# Altium schematic sheet ee453_pcb_ret.SchDoc: EE 453 Capstone
size C; ApprovedBy: Your Name; CheckedBy: Your Name; Author: Your Name; CompanyName: Dept. of Elec. and Comp. Engg.; DrawnBy: Your Name; Engineer: Your Nmae; Organization: UW-Seattle; Address1: 185 Stevens Way; Address2: Paul Allen Center; Address3: Seattle, WA; Address4: US-98195; DocumentNumber: 1; Revision: 1.0; SheetNumber: 1; SheetTotal: 1
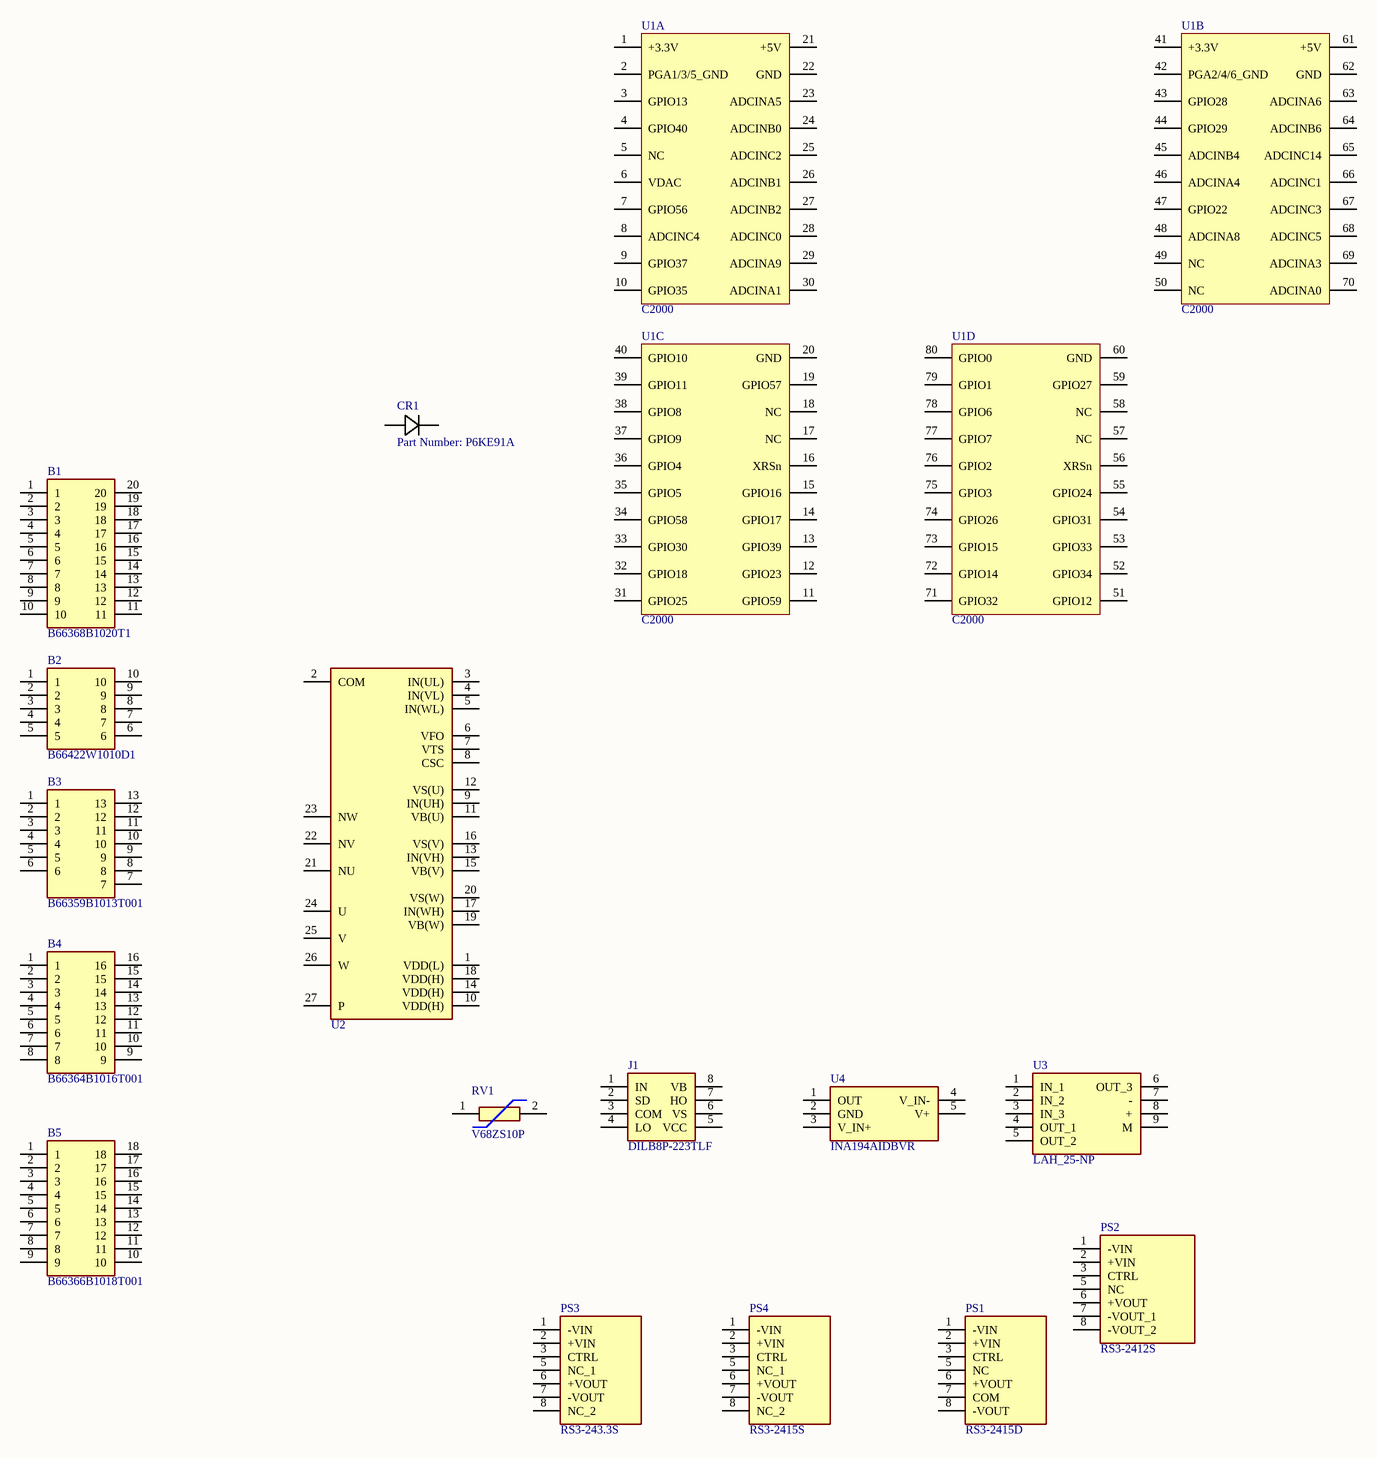
[diagram p0: ee453_pcb_ret.SchDoc]

## Parts
B1  B66368B1020T1  [B66368B1020T1]
B2  B66422W1010D1  [B66422W1010D1]
B3  B66359B1013T001  [B66359B1013T001]
B4  B66364B1016T001  [B66364B1016T001]
B5  B66366B1018T001  [B66366B1018T001]
CR1  Part Number: P6KE91A  [P6KESeries]
J1  DILB8P-223TLF  [DIPS762W60P254L1016H525Q8N]
PS1  RS3-2415D  [RS32405DH3]
PS2  RS3-2412S  [RS32415S]
PS3  RS3-243.3S  [RS32433S]
PS4  RS3-2415S  [RS32415S]
RV1  V68ZS10P  [V68ZS10P]
U1  C2000  [C2000]  (parts A,B,C,D of 4)
U2  FNB34060T  [FNB34060T]  (value not drawn)
U3  LAH_25-NP  [LAH-25-NP]
U4  INA194AIDBVR  [SOT95P280X145-5N]

## Nets

Not connected (* = marked no-connect by the designer): B1 1 2 3 4 5 6 7 8 9 10 11 12 13 14 15 16 17 18 19 20; B2 1 2 3 4 5 6 7 8 9 10; B3 1 2 3 4 5 6 7 8 9 10 11 12 13; B4 1 2 3 4 5 6 7 8 9 10 11 12 13 14 15 16; B5 1 2 3 4 5 6 7 8 9 10 11 12 13 14 15 16 17 18; CR1 1 2; J1 1(IN) 2(SD) 3(COM) 4(LO) 5(VCC) 6(VS) 7(HO) 8(VB); PS1 1(-VIN) 2(+VIN) 3(CTRL) 5(NC) 6(+VOUT) 7(COM) 8(-VOUT); PS2 1(-VIN) 2(+VIN) 3(CTRL) 5(NC) 6(+VOUT) 7(-VOUT_1) 8(-VOUT_2); PS3 1(-VIN) 2(+VIN) 3(CTRL) 5(NC_1) 6(+VOUT) 7(-VOUT) 8(NC_2); PS4 1(-VIN) 2(+VIN) 3(CTRL) 5(NC_1) 6(+VOUT) 7(-VOUT) 8(NC_2); RV1 1 2; U1 1(+3.3V) 2(PGA1/3/5_GND) 3(GPIO13) 4(GPIO40) 5(NC) 6(VDAC) 7(GPIO56) 8(ADCINC4) 9(GPIO37) 10(GPIO35) 11(GPIO59) 12(GPIO23) 13(GPIO39) 14(GPIO17) 15(GPIO16) 16(XRSn) 17(NC) 18(NC) 19(GPIO57) 20(GND) 21(+5V) 22(GND) 23(ADCINA5) 24(ADCINB0) 25(ADCINC2) 26(ADCINB1) 27(ADCINB2) 28(ADCINC0) 29(ADCINA9) 30(ADCINA1) 31(GPIO25) 32(GPIO18) 33(GPIO30) 34(GPIO58) 35(GPIO5) 36(GPIO4) 37(GPIO9) 38(GPIO8) 39(GPIO11) 40(GPIO10) 41(+3.3V) 42(PGA2/4/6_GND) 43(GPIO28) 44(GPIO29) 45(ADCINB4) 46(ADCINA4) 47(GPIO22) 48(ADCINA8) 49(NC) 50(NC) 51(GPIO12) 52(GPIO34) 53(GPIO33) 54(GPIO31) 55(GPIO24) 56(XRSn) 57(NC) 58(NC) 59(GPIO27) 60(GND) 61(+5V) 62(GND) 63(ADCINA6) 64(ADCINB6) 65(ADCINC14) 66(ADCINC1) 67(ADCINC3) 68(ADCINC5) 69(ADCINA3) 70(ADCINA0) 71(GPIO32) 72(GPIO14) 73(GPIO15) 74(GPIO26) 75(GPIO3) 76(GPIO2) 77(GPIO7) 78(GPIO6) 79(GPIO1) 80(GPIO0); U2 1(VDD(L)) 2(COM) 3(IN(UL)) 4(IN(VL)) 5(IN(WL)) 6(VFO) 7(VTS) 8(CSC) 9(IN(UH)) 10(VDD(H)) 11(VB(U)) 12(VS(U)) 13(IN(VH)) 14(VDD(H)) 15(VB(V)) 16(VS(V)) 17(IN(WH)) 18(VDD(H)) 19(VB(W)) 20(VS(W)) 21(NU) 22(NV) 23(NW) 24(U) 25(V) 26(W) 27(P); U3 1(IN_1) 2(IN_2) 3(IN_3) 4(OUT_1) 5(OUT_2) 6(OUT_3) 7(-) 8(+) 9(M); U4 1(OUT) 2(GND) 3(V_IN+) 4(V_IN-) 5(V+)

## Notes on the sheet
- Title
- Size:
- Date:
- File:
- C
- Number:
- Time:
- Revision:
- Sheet
- of

## Library data of the parts
B1 = B66368B1020T1: Bobbin; Manufacturer_Name: EPCOS; Datasheet Link: https://componentsearchengine.com/Datasheets/1/B66368B1020T1.pdf; Height: 40.9mm; Mouser2 Part Number: 871-B66368B1020T1; Mouser2 Price/Stock: https://www.mouser.com/Search/Refine.aspx?Keyword=871-B66368B1020T1; Manufacturer_Part_Number: B66368B1020T1
B2 = B66422W1010D1: Bobbin; Manufacturer_Name: EPCOS; Datasheet Link: https://componentsearchengine.com/Datasheets/1/B66422W1010D1.pdf; Height: 12mm; Mouser2 Part Number: 871-B66422W1010D1; Mouser2 Price/Stock: https://www.mouser.com/Search/Refine.aspx?Keyword=871-B66422W1010D1; Manufacturer_Part_Number: B66422W1010D1
B3 = B66359B1013T001: Bobbin; Manufacturer_Name: EPCOS; Datasheet Link: https://componentsearchengine.com/Datasheets/1/B66359B1013T001.pdf; Height: 25mm; Mouser2 Part Number: 871-B66359B1013T001; Mouser2 Price/Stock: https://www.mouser.com/Search/Refine.aspx?Keyword=871-B66359B1013T001; Manufacturer_Part_Number: B66359B1013T001
B4 = B66364B1016T001: Bobbin; Manufacturer_Name: EPCOS; Datasheet Link: https://componentsearchengine.com/Datasheets/1/B66364B1016T001.pdf; Height: 35.5mm; Mouser2 Part Number: 871-B66364B1016T001; Mouser2 Price/Stock: https://www.mouser.com/Search/Refine.aspx?Keyword=871-B66364B1016T001; Manufacturer_Part_Number: B66364B1016T001
B5 = B66366B1018T001: Bobbin; Manufacturer_Name: EPCOS; Datasheet Link: http://uk.rs-online.com/web/p/products/1620179; Height: 38.4mm; Manufacturer_Part_Number: B66366B1018T001; RS Part Number: 1620179; RS Price/Stock: http://uk.rs-online.com/web/p/products/1620179
CR1 = P6KE91A: No Description Available; Vendor: Littelfuse Inc; Built_By: EMA_UL_Team; Type: DEV; Manufacturer_Part_Number: P6KE91A; Copyright: Copyright (C) 2018 Accelerated Designs. All rights reserved; RefDes: RefDes; Value: Value
J1 = DILB8P-223TLF: Connector; Manufacturer_Name: Amphenol; Datasheet Link: https://componentsearchengine.com/Datasheets/1/DILB8P-223TLF.pdf; Height: 5.25mm; Mouser2 Part Number: 649-DILB8P223TLF; Mouser2 Price/Stock: https://www.mouser.com/Search/Refine.aspx?Keyword=649-DILB8P223TLF; Manufacturer_Part_Number: DILB8P-223TLF
PS1 = RS3-2415D: Power Supply; Manufacturer_Name: RECOM Power; Allied_Number: 70052275; Datasheet Link: https://www.recom-power.com/pdf/Econoline/RS3-S_D_Z.pdf; Height: 11.35mm; Manufacturer_Part_Number: RS3-2415D; Mouser Part Number: 919-RS3-2415D; Mouser Price/Stock: https://www.mouser.com/Search/Refine.aspx?Keyword=919-RS3-2415D; RS Part Number: 1669089; RS Price/Stock: https://uk.rs-online.com/web/p/products/1669089; Allied Price/Stock: https://www.alliedelec.com/recom-power-inc-rs3-2415d/70052275/
PS2 = RS3-2412S: Power Supply; Manufacturer_Name: RECOM Power; Datasheet Link: https://www.recom-power.com/pdf/Econoline/RS3-S_D_Z.pdf; Manufacturer_Part_Number: RS3-2412S; Mouser Part Number: 919-RS3-2412S; Mouser Price/Stock: https://www.mouser.com/Search/Refine.aspx?Keyword=919-RS3-2412S; RS Part Number: 1669097; RS Price/Stock: https://uk.rs-online.com/web/p/products/1669097
PS3 = RS3-243.3S: Power Supply; Manufacturer_Name: RECOM Power; Datasheet Link: https://www.arrow.com/en/products/rs3-243.3s/recom-power; Height: 11.35mm; Manufacturer_Part_Number: RS3-243.3S; Mouser Part Number: 919-RS3-243.3S; Mouser Price/Stock: https://www.mouser.com/Search/Refine.aspx?Keyword=919-RS3-243.3S; RS Part Number: 0163748P; RS Price/Stock: http://uk.rs-online.com/web/p/products/0163748P
PS4 = RS3-2415S: Power Supply; Manufacturer_Name: RECOM Power; Datasheet Link: https://www.recom-power.com/pdf/Econoline/RS3-S_D_Z.pdf; Height: 11.35mm; Manufacturer_Part_Number: RS3-2415S; Mouser Part Number: 919-RS3-2415S; Mouser Price/Stock: https://www.mouser.com/Search/Refine.aspx?Keyword=919-RS3-2415S
RV1 = V68ZS10P: Varistor; Manufacturer_Name: LITTELFUSE; Datasheet Link: http://www.littelfuse.com/~/media/electronics/datasheets/varistors/littelfuse_varistor_za_datasheet.pdf.pdf; Height: 20mm; Manufacturer_Part_Number: V68ZS10P
U1 = C2000: F280049C; Parameter 1: test 2
U3 = LAH_25-NP: Integrated Circuit; Manufacturer_Name: LEM; Manufacturer_Part_Number: LAH 25-NP; Datasheet Link: http://www.lem.com/docs/products/lah_25-np.pdf
U4 = INA194AIDBVR: Integrated Circuit; Manufacturer_Name: Texas Instruments; Datasheet Link: http://www.ti.com/lit/gpn/ina194; Height: 1.45mm; Manufacturer_Part_Number: INA194AIDBVR